# EAGLE design CAN3 (EAGLE 7.3.0)
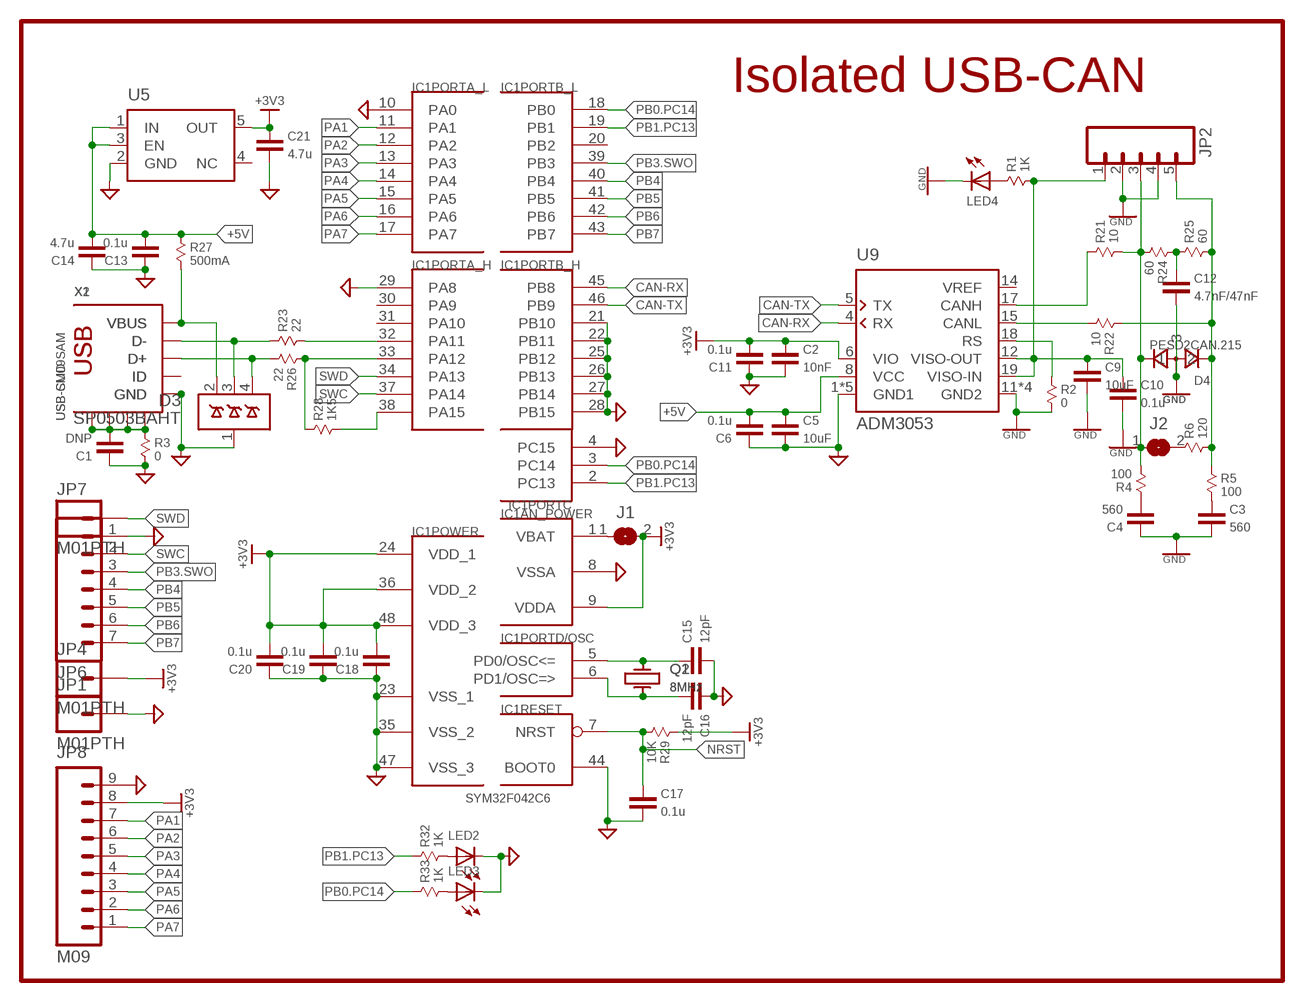
[diagram p0: schematic, sheet 1]

## Parts
C1  DNP  CAP-0603  [0603]
C2  10nF  CAP-0603  [0603]
C3  560  CAP-0603  [0603]
C4  560  CAP-0603  [0603]
C5  10uF  CAP-0805  [0805]
C6  0.1u  CAP-0603  [0603]
C9  10uF  CAP-0805  [0805]
C10  0.1u  CAP-0603  [0603]
C11  0.1u  CAP-0603  [0603]
C12  4.7nF/47nF  CAP-0603  [0603]
C13  0.1u  CAP-0603  [0603]
C14  4.7u  CAP-0603  [0603]
C15  12pF  CAP-0603  [0603]
C16  12pF  CAP-0603  [0603]
C17  0.1u  CAP-0603  [0603]
C18  0.1u  CAP-0603  [0603]
C19  0.1u  CAP-0603  [0603]
C20  0.1u  CAP-0603  [0603]
C21  4.7u  CAP-0603  [0603]
D3  SP0503BAHT  [SOT143]
D4  PESD2CAN.215  DIODE-2A-SOT23  [SOT-23]
IC1  SYM32F042C6  STM32F10XCXT6  [TQFP48]
J1  JUMPER2-0402  [JUMPER2-0402]
J2  JUMPER2-0402  [JUMPER2-0402]
JP1  M01PTH  [1X01]
JP2  M05PTH  [1X05]
JP4  M01PTH  [1X01]
JP6  M07  [1X07]
JP7  M01PTH  [1X01]
JP8  M09  [1X09]
LED2  LEDCHIPLED_0603  [CHIPLED_0603]
LED3  LEDCHIPLED_0603  [CHIPLED_0603]
LED4  LEDCHIPLED_0603  [CHIPLED_0603]
Q1  8MHz  CRYSTAL-KX-9A  [KX-9A]
Q2  8MHz  CRYSTAL-KX-7  [KX-7]
R1  1K  RESISTOR-0603  [0603]
R2  0  RESISTOR-0603  [0603]
R3  0  RESISTOR-0603  [0603]
R4  100  RESISTOR-0603  [0603]
R5  100  RESISTOR-0603  [0603]
R6  120  RESISTOR-0603  [0603]
R21  10  RESISTOR-0603  [0603]
R22  10  RESISTOR-0603  [0603]
R23  22  RESISTOR-0603  [0603]
R24  60  RESISTOR-0603  [0603]
R25  60  RESISTOR-0603  [0603]
R26  22  RESISTOR-0603  [0603]
R27  500mA  RESISTOR-0805  [0805]
R28  1K5  RESISTOR-0603  [0603]
R29  10K  RESISTOR-0603  [0603]
R32  1K  RESISTOR-0603  [0603]
R33  1K  RESISTOR-0603  [0603]
U5  TPS73033  [SOT23-5]
U9  ADM3053  [SO20W]
X1  USB-SMD  [USB-MINIB]
X2  USB-CU09SAM  [CU09SAM]

## Nets
+3V3: C2.2 C11.1 C18.1 C19.1 C20.1 C21.2 IC1.9(AN_POWER:VDDA) IC1.24(POWER:VDD_1) IC1.36(POWER:VDD_2) IC1.48(POWER:VDD_3) J1.2 JP4.1 JP8.8 R29.1 U5.5(OUT) U9.6(VIO)
+5V: C5.2 C6.1 C13.1 C14.1 R27.1 U5.1(IN) U5.3(EN) U9.8(VCC)
CAN-H: D4.1 J2.1 JP2.3 R4.2 R21.2 R24.2
CAN-L: D4.2 JP2.5 R5.1 R6.2 R22.1 R25.2
CAN-RX: IC1.45(PORTB_H:PB8) U9.4(RX)
CAN-TX: IC1.46(PORTB_H:PB9) U9.5(TX)
CANH: R21.1 U9.17(CANH)
CANL: R22.2 U9.15(CANL)
GNDA: C3.1 C4.2 C9.1 C10.1 C12.1 D4.3 JP2.2 JP2.4 LED4.C R2.2 U9.11(GND2) U9.13(GND2) U9.16(GND2) U9.20(GND2) ; supply symbol labelled GND
GNDD: C1.2 C2.1 C5.1 C6.2 C11.2 C13.2 C14.2 C15.1 C16.2 C17.1 C18.2 C19.2 C20.2 C21.1 D3.1(GND) IC1.4(PORTC:PC15) IC1.8(AN_POWER:VSSA) IC1.10(PORTA_L:PA0) IC1.21(PORTB_H:PB10) IC1.22(PORTB_H:PB11) IC1.23(POWER:VSS_1) IC1.25(PORTB_H:PB12) IC1.26(PORTB_H:PB13) IC1.27(PORTB_H:PB14) IC1.28(PORTB_H:PB15) IC1.29(PORTA_H:PA8) IC1.35(POWER:VSS_2) IC1.44(RESET:BOOT0) IC1.47(POWER:VSS_3) JP1.1 JP6.1 JP8.9 LED2.C LED3.C R3.2 U5.2(GND) U9.1(GND1) U9.3(GND1) U9.7(GND1) U9.9(GND1) U9.10(GND1) X1.GND X2.5(GND) ; supply symbol labelled GND
N$1: LED4.A R1.1
N$2: R2.1 U9.18(RS)
N$3: C12.2 R24.1 R25.1
N$4: X1.ID X2.4(ID)
N$5: C1.1 R3.1 X1.GND@1(GND) X1.GND@2(GND) X1.GND@3(GND) X1.GND@4(GND) X2.GND@1(GND) X2.GND@2(GND) X2.GND@3(GND) X2.GND@4(GND)
N$6: IC1.1(AN_POWER:VBAT) J1.1
N$7: IC1.32(PORTA_H:PA11) R23.2
N$8: LED2.A R32.2
N$9: C3.2 R5.2
N$10: C4.1 R4.1
N$11: J2.2 R6.1
N$13: LED3.A R33.2
N$14: IC1.33(PORTA_H:PA12) R26.1 R28.1
N$15: D3.4(D3) R26.2 X1.D+ X2.3(D+)
N$16: D3.3(D2) R23.1 X1.D- X2.2(D-)
N$18: D3.2(D1) R27.2 X1.VBUS X2.1(VBUS)
N$23: IC1.38(PORTA_H:PA15) R28.2
N$24: C15.2 IC1.5(PORTD/OSC:PD0/OSC<=) Q1.1 Q2.1
N$25: C16.1 IC1.6(PORTD/OSC:PD1/OSC=>) Q1.3 Q2.3
NRST: C17.2 IC1.7(RESET:NRST) R29.2
PA1: IC1.11(PORTA_L:PA1) JP8.7
PA2: IC1.12(PORTA_L:PA2) JP8.6
PA3: IC1.13(PORTA_L:PA3) JP8.5
PA4: IC1.14(PORTA_L:PA4) JP8.4
PA5: IC1.15(PORTA_L:PA5) JP8.3
PA6: IC1.16(PORTA_L:PA6) JP8.2
PA7: IC1.17(PORTA_L:PA7) JP8.1
PB0.PC14: IC1.3(PORTC:PC14) IC1.18(PORTB_L:PB0) R33.1
PB1.PC13: IC1.2(PORTC:PC13) IC1.19(PORTB_L:PB1) R32.1
PB3.SWO: IC1.39(PORTB_L:PB3) JP6.3
PB4: IC1.40(PORTB_L:PB4) JP6.4
PB5: IC1.41(PORTB_L:PB5) JP6.5
PB6: IC1.42(PORTB_L:PB6) JP6.6
PB7: IC1.43(PORTB_L:PB7) JP6.7
SWC: IC1.37(PORTA_H:PA14) JP6.2
SWD: IC1.34(PORTA_H:PA13) JP7.1
VCC2: C9.2 C10.2 JP2.1 R1.2 U9.12(VISO-OUT) U9.19(VISO-IN)
Unconnected: IC1.20(PORTB_L:PB2) IC1.30(PORTA_H:PA9) IC1.31(PORTA_H:PA10) U5.4(NC) U9.14(VREF)

## Notes on the sheet
- Isolated USB-CAN

## Library data of the parts
C1-C6 C9-C21 = X893:CAP: Capacitor
D3 = X893:SP0503BAHT: Surface Mount TVS Avalanche Diode Array (5V) http://www.littelfuse.com/data/en/Data_Sheets/SP05xxBA.pdf
D4 = X893:DIODE-2A: http://www.nxp.com/documents/data_sheet/BAT54W.pdf
IC1 = stm32:STM32F10XCXT6: ST STM32F101/103 48pin LQFP
J1 J2 = we-rcl:JUMPER2: 2 Pin Jumpers
JP1 JP4 JP7 = SparkFun:M01: Header 1 Standard 1-pin 0.1" header. Use with straight break away headers (SKU : PRT-00116), right angle break away headers (PRT-00553), swiss pins (PRT-00743), machine pins (PRT-00117), and female headers (PRT-00115).
JP2 = SparkFun:M05: Header 5 Standard 5-pin 0.1" header. Use with straight break away headers (SKU : PRT-00116), right angle break away headers (PRT-00553), swiss pins (PRT-00743), machine pins (PRT-00117), and female headers (PRT-00115). Molex polarized connector foot print use with SKU : PRT-08230 with associated crimp pins and housings.
JP6 = SparkFun:M07: Header 7 Standard 7-pin 0.1" header. Use with straight break away headers (SKU : PRT-00116), right angle break away headers (PRT-00553), swiss pins (PRT-00743), machine pins (PRT-00117), and female headers (PRT-00115). NOTES ON THE VARIANTS LOCK and LOCK_LONGPADS... This footprint was designed to help hold the alignment of a through-hole component (i.e. 7-pin header) while soldering it into place. You may notice that each hole has been shifted either up or down by 0.005 of an inch from it's more standard position (which is usually a perfectly straight line). This slight alteration caused the pins (the squares in the middle) to touch the edges of the holes. Because they are alternating, it causes a "brace" to hold the header in place. 0.005 has proven to be the perfect amount of "off-center" position when using our standard breakaway headers. Although looks a little odd when you look at the bare footprint, once you have a header in there, the alteration is very hard to notice. Also, if you push a header all the way into place, it is covered up entirely on the bottom side. This idea of altering the position of holes to aid alignment will be further integrated into the Sparkfun Library for other footprints. It can help hold any component with 3 or more connection pins.
JP8 = SparkFun:M09: Header 9 Standard 9-pin 0.1" header. Use with straight break away headers (SKU : PRT-00116), right angle break away headers (PRT-00553), swiss pins (PRT-00743), machine pins (PRT-00117), and female headers (PRT-00115).
LED2-LED4 = led:LED: LED OSRAM: - CHIPLED LG R971, LG N971, LY N971, LG Q971, LY Q971, LO R971, LY R971 LH N974, LH R974 LS Q976, LO Q976, LY Q976 LO Q996 - Hyper CHIPLED LW Q18S LB Q993, LB Q99A, LB R99A - SideLED LS A670, LO A670, LY A670, LG A670, LP A670 LB A673, LV A673, LT A673, LW A673 LH A674 LY A675 LS A676, LA A676, LO A676, LY A676, LW A676 LS A679, LY A679, LG A679 - Hyper Micro SIDELED® LS Y876, LA Y876, LO Y876, LY Y876 LT Y87S - SmartLED LW L88C, LW L88S LB L89C, LB L89S, LG L890 LS L89K, LO L89K, LY L89K LS L896, LA L896, LO L896, LY L896 - TOPLED LS T670, LO T670, LY T670, LG T670, LP T670 LSG T670, LSP T670, LSY T670, LOP T670, LYG T670 LG T671, LOG T671, LSG T671 LB T673, LV T673, LT T673, LW T673 LH T674 LS T676, LA T676, LO T676, LY T676, LB T676, LH T676, LSB T676, LW T676 LB T67C, LV T67C, LT T67C, LS T67K, LO T67K, LY T67K, LW E67C LS E67B, LA E67B, LO E67B, LY E67B, LB E67C, LV E67C, LT E67C LW T67C LS T679, LY T679, LG T679 LS T770, LO T770, LY T770, LG T770, LP T770 LB T773, LV T773, LT T773, LW T773 LH T774 LS E675, LA E675, LY E675, LS T675 LS T776, LA T776, LO T776, LY T776, LB T776 LHGB T686 LT T68C, LB T68C - Hyper Mini TOPLED® LB M676 - Mini TOPLED Santana® LG M470 LS M47K, LO M47K, LY M47K Source: http://www.osram.convergy.de LUXEON: - LUMILED® LXK2-PW12-R00, LXK2-PW12-S00, LXK2-PW14-U00, LXK2-PW14-V00 LXK2-PM12-R00, LXK2-PM12-S00, LXK2-PM14-U00 LXK2-PE12-Q00, LXK2-PE12-R00, LXK2-PE12-S00, LXK2-PE14-T00, LXK2-PE14-U00 LXK2-PB12-K00, LXK2-PB12-L00, LXK2-PB12-M00, LXK2-PB14-N00, LXK2-PB14-P00, LXK2-PB14-Q00 LXK2-PR12-L00, LXK2-PR12-M00, LXK2-PR14-Q00, LXK2-PR14-R00 LXK2-PD12-Q00, LXK2-PD12-R00, LXK2-PD12-S00 LXK2-PH12-R00, LXK2-PH12-S00 LXK2-PL12-P00, LXK2-PL12-Q00, LXK2-PL12-R00 Source: www.luxeon.com KINGBRIGHT: KA-3528ASYC Source: www.kingbright.com
Q1 Q2 = X893:CRYSTAL: KX-9A <http://www.kosmodrom.com.ua/pdf/KX-9A.pdf> KX-KT <http://www.kosmodrom.com.ua/pdf/KX-K.pdf>
R1-R6 R21-R29 R32 R33 = X893:RESISTOR
U5 = X893:TPS73033: LOW-NOISE, HIGH PSRR, RF 200-mA LOW-DROPOUT LINEAR REGULATOR http://www.terraelectronica.ru/pdf/TI/TPS73033.pdf
U9 = X893:ADM3053: ADM3053 <http://www.analog.com/media/en/technical-documentation/data-sheets/ADM3053.pdf> EVAL–ADM3053EBZ <http://www.analog.com/media/en/technical-documentation/user-guides/UG-234.pdf>
X1 X2 = X893:USB: USB Connectors USB-B-PTH is fully proven SKU : PRT-00139 USB-miniB is fully proven SKU : PRT-00587 USB-A-PCB is untested. USB-A-H is throughly reviewed, but untested. Spark Fun Electronics SKU : PRT-00437 USB-B-SMT is throughly reviewed, but untested. Needs silkscreen touching up. USB-A-S has not been used/tested USB-MB-H has not been used/tested

## Board
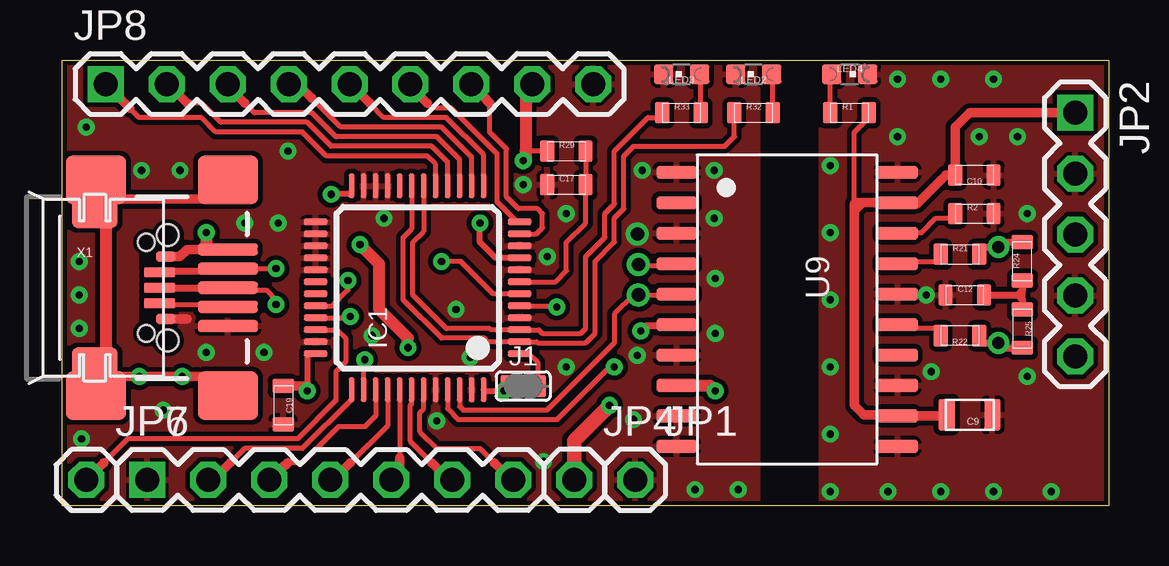
[diagram p1: board, top side]
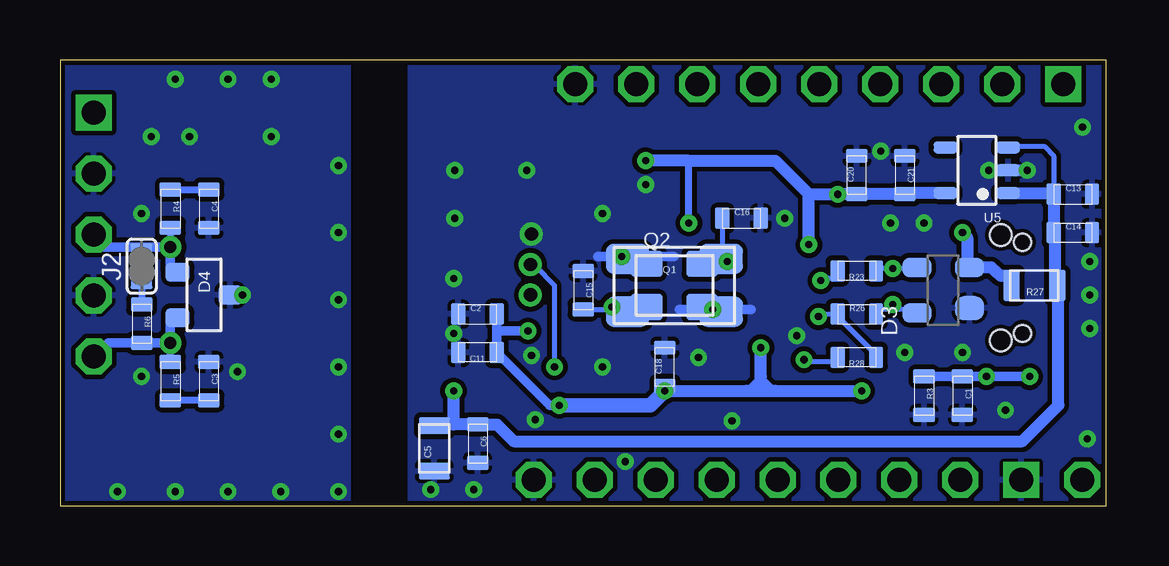
[diagram p2: board, bottom side, seen from below]

Size 43.6 x 18.6 mm. Coordinates in mm from the lower left corner, seen from the top.
Outline: 0,0 0,18.6 43.6,18.6 43.6,0 0,0
Copper layers (1+16): Top 0.018mm / dielectric 0.8mm / Bottom 0.018mm
Design rules "Rezonit-015": minimum track width 0.15mm, minimum drill 0.3mm, track to track 0.15mm, track to pad 0.15mm, pad to pad 0.15mm, via to via 0.15mm, smd to smd 0mil, copper to edge 0.2mm, drill to drill 0.3mm, minimum pad ring 0.2mm, minimum via ring 0.2mm, stop-mask expansion 4mil, vias tented up to drill 0.3mm, thermal gap 0.15mm

### Footprints (pad centres in the part's own frame; a part is rotated, then mirrored left to right if it is on the bottom)
0603 = smd 0.6 x 0.9: 1 -0.8,0; 2 0.8,0
0805 = smd 0.7 x 1.3: 1 -0.95,0; 2 0.95,0
SOT143 = smd 1 x 1.2: 1 -0.75,-1.1 | smd 0.8 x 1.2: 2 0.95,-1.1; 3 0.95,1.1; 4 -0.95,1.1
SOT-23 = smd 0.8 x 1: 1 -0.95,-1.1; 2 0.95,-1.1; 3 0,1.1
TQFP48 = smd 0.25 x 1: 1 -2.75,-4.25; 2 -2.25,-4.25; 3 -1.75,-4.25; 4 -1.25,-4.25; 5 -0.75,-4.25; 6 -0.25,-4.25; 7 0.25,-4.25; 8 0.75,-4.25; 9 1.25,-4.25; 10 1.75,-4.25; 11 2.25,-4.25; 12 2.75,-4.25; 25 2.75,4.25; 26 2.25,4.25; 27 1.75,4.25; 28 1.25,4.25; 29 0.75,4.25; 30 0.25,4.25; 31 -0.25,4.25; 32 -0.75,4.25; 33 -1.25,4.25; 34 -1.75,4.25; 35 -2.25,4.25; 36 -2.75,4.25 | smd 1 x 0.25: 13 4.25,-2.75; 14 4.25,-2.25; 15 4.25,-1.75; 16 4.25,-1.25; 17 4.25,-0.75; 18 4.25,-0.25; 19 4.25,0.25; 20 4.25,0.75; 21 4.25,1.25; 22 4.25,1.75; 23 4.25,2.25; 24 4.25,2.75; 37 -4.25,2.75; 38 -4.25,2.25; 39 -4.25,1.75; 40 -4.25,1.25; 41 -4.25,0.75; 42 -4.25,0.25; 43 -4.25,-0.25; 44 -4.25,-0.75; 45 -4.25,-1.25; 46 -4.25,-1.75; 47 -4.25,-2.25; 48 -4.25,-2.75
JUMPER2-0402 = smd 0.9 x 0.8: 1 0,0.55; 2 0,-0.55
1X01 = drill 1 pad 1.5 octagon: 1 0,0
1X05 = drill 1 pad 1.5 square: 1 0,0 | drill 1 pad 1.5 octagon: 2 2.54,0; 3 5.08,0; 4 7.62,0; 5 10.16,0
1X07 = drill 1 pad 1.5 square: 1 0,0 | drill 1 pad 1.5 octagon: 2 2.54,0; 3 5.08,0; 4 7.62,0; 5 10.16,0; 6 12.7,0; 7 15.24,0
1X09 = drill 1 pad 1.5 square: 1 0,0 | drill 1 pad 1.5 octagon: 2 2.54,0; 3 5.08,0; 4 7.62,0; 5 10.16,0; 6 12.7,0; 7 15.24,0; 8 17.78,0; 9 20.32,0
CHIPLED_0603 = smd 0.8 x 0.8: A 0,-0.75; C 0,0.75
KX-9A = smd 1.8 x 1.25: 1 -1.95,-1.1; 2 1.95,-1.1; 3 1.95,1.1; 4 -1.95,1.1
KX-7 = smd 1.3 x 1.1: 1 -1.15,-0.9; 2 1.15,-0.9; 3 1.15,0.9; 4 -1.15,0.9
SOT23-5 = smd 0.5 x 1: 1 -0.95,-1.3; 2 0,-1.3; 3 0.95,-1.3; 4 0.95,1.3; 5 -0.95,1.3
SO20W = smd 0.55 x 1.7: 1 -5.715,-4.6; 2 -4.445,-4.6; 3 -3.175,-4.6; 4 -1.905,-4.6; 5 -0.635,-4.6; 6 0.635,-4.6; 7 1.905,-4.6; 8 3.175,-4.6; 9 4.445,-4.6; 10 5.715,-4.6; 11 5.715,4.6; 12 4.445,4.6; 13 3.175,4.6; 14 1.905,4.6; 15 0.635,4.6; 16 -0.635,4.6; 17 -1.905,4.6; 18 -3.175,4.6; 19 -4.445,4.6; 20 -5.715,4.6
USB-MINIB = smd 2.5 x 0.5: D+ 2.5,0; D- 2.5,0.8; GND 2.5,-1.6; ID 2.5,-0.8; VBUS 2.5,1.6 | smd 2.5 x 2: GND@1 -3,-4.5; GND@2 -3,4.5; GND@3 2.5,4.5; GND@4 2.5,-4.5 | hole 0.9: 0,2.2; 0,-2.2
CU09SAM = smd 0.4 x 0.8: 1 1.3,-5.1; 5 -1.3,-5.1 | smd 0.4 x 1.3: 2 0.65,-4.85; 3 0,-4.85; 4 -0.65,-4.85 | smd 1.8 x 1.9: GND@1 -3.4,-2.15; GND@4 3.4,-2.15 | smd 1 x 1: GND@2 -3.2,-2.2; GND@3 3.2,-2.2 | hole 0.7: -1.9,-4.3; 1.9,-4.3

### Placement (x,y rotation side)
C1  6,4.6 270 bottom
C2  26.2,8 0 bottom
C3  37.4,5.2 270 bottom
C4  37.4,12.4 270 bottom
C5  28,2.4 90 bottom
C6  26.2,2.6 270 bottom
C9  37.8,3.8 180 top
C10  38,13.8 180 top
C11  26.2,6.4 180 bottom
C12  37.6,8.8 0 top
C13  1.4,13 0 bottom
C14  1.4,11.4 0 bottom
C15  21.8,9 270 bottom
C16  15.2,12 0 bottom
C17  21,13.4 0 top
C18  18.4,5.8 90 bottom
C19  9.2,4.2 270 top
C20  10.4,13.8 90 bottom
C21  8.4,13.8 270 bottom
D3  6.8,9 90 bottom
D4  37.6,8.8 270 bottom
IC1  14.8,9.1 90 top
J1  19.2,5 270 top
J2  40.2,10 0 bottom
JP1  23.86,1.08 0 top
JP2  42.2,16.4 270 top
JP4  21.32,1.08 0 top
JP6  3.54,1.08 0 top
JP7  1,1.08 0 top
JP8  1.8,17.59 0 top
LED2  28.8,18 90 top
LED3  25.8,18 90 top
LED4  32.8,18 270 top
Q1  18,9.2 0 bottom
Q2  18,9.2 0 bottom
R1  32.8,16.4 0 top
R2  38,12.2 0 top
R3  7.6,4.6 270 bottom
R4  39,12.4 270 bottom
R5  39,5.2 270 bottom
R6  40.2,7.6 270 bottom
R21  37.4,10.5 0 top
R22  37.4,7.1 180 top
R23  10.4,9.8 180 bottom
R24  40,10.2 90 top
R25  40,7.4 270 top
R26  10.4,8 0 bottom
R27  3,9.2 180 bottom
R28  10.4,6.2 180 bottom
R29  21,14.8 0 top
R32  28.8,16.4 0 top
R33  25.8,16.4 0 top
U5  5.4,14 90 bottom
U9  30.2,8.2 270 top
X1  4.4,9.1 0 top
X2  -0.8,9.1 90 top

### Tracks (layer width: path | path; a pad name or v marks a point on that pad's centre or on a via)
+3V3  (via drill 0.3)
  Top 0.2: IC1.36 10.2,6.35 | IC1.24 12,13 | 12.5,10.9 v12.4,10.9 | R29.1 19.3,14.8 | J1.2 v18.4,4.8
  Top 0.25: 10.2,6.35 10.2,5 | IC1.9 18.05,10.35 17.4,11 v17.4,11.8 | 12,13 v11.2,13 | IC1.48 17.6,4.8 v18.4,4.8
  Top 0.3: U9.6 25.5,7.5 24.3,7.5 v24.1,7.3
  Top 0.4: C19.1 10.2,5 v10.2,4.8
  Top 0.5: v14.4,6.6 14.4,7 13.2,8.2 13.2,10.1 v12.4,10.9 | JP8.8 19.3,17.31 19.3,14.8 19.3,14.4 v19.2,14.4
  Top 0.6: JP4.1 21.32,2.72 v22.8,4.2
  Bottom 0.2: 15,4.8 14.4,5.4 13.8,4.8 | C18.1 v18.4,4.8
  Bottom 0.3: v17.4,11.8 17.4,14.4
  Bottom 0.4: v22.8,4.2 23.2,4.2 C11.1 25.4,7.3 | C2.2 25.4,7.3 | v24.1,7.3 25.4,7.3
  Bottom 0.5: v18.4,4.8 15,4.8 14.4,4.8 | 14.4,4.8 13.8,4.8 v10.2,4.8 | 12.4,13 v11.2,13 C20.1 C21.2 8.4,13.05 U5.5 | v12.4,10.9 12.4,13 | 12.4,13 13.8,14.4 17.4,14.4 v19.2,14.4 | 14.4,4.8 14.4,5.4 v14.4,6.6
  Bottom 0.6: v18.4,4.8 19,4.2 v22.8,4.2
+5V  (via drill 0.3)  (1 unrouted)
  Top 0.5: U9.8 26.98,5.03 v27.2,4.8
  Bottom 0.2: 2.2,13.05 2.2,14.6 2.6,15 4.05,15 U5.3 4.15,14.95
  Bottom 0.5: U5.1 2.2,13.05 C14.1 2.15,11.4 2.15,9.2 R27.1 2,9.15 2,4.2 3.5,2.7 24.7,2.7 25.4,3.4 C6.1 27.2,3.4 | C5.2 28,3.4 27.2,3.4 | 27.2,3.4 v27.2,4.8
CAN-H  (via drill 0.5)
  Top 0.3: 38.35,10.55 R21.2 38.2,10.8 v39,10.8 39.2,11 R24.2
  Bottom 0.3: D4.1 38.7,9.8 | R4.2 v39,10.8 | J2.1 40.2,10.8
  Bottom 0.4: 38.6,9.8 38.7,9.8 39,9.8 v39,10.8 40.2,10.8 42.12,10.8 42.12,11.32 JP2.3
CAN-L  (via drill 0.5)
  Top 0.3: 38.35,7.05 R22.1 38.2,6.8 v39,6.8 39.2,6.6 R25.2
  Bottom 0.3: D4.2 38.75,7.85 38.6,7.8 | R5.1 v39,6.8
  Bottom 0.4: 38.6,7.8 39,7.8 v39,6.8 R6.2 41.6,6.8 42.16,6.24 JP2.5
CAN-RX  (via drill 0.3, 0.56)
  Top 0.2: U9.4 25.5,10 24,10 v24,10.07 | v23,5.8 22.8,5.8 20.6,3.6 16.5,3.6 16.05,4.05 IC1.45
  Bottom 0.2: v24,10.07 24,10 23.8,10 23,9.2 v23,5.8
CAN-TX  (via drill 0.56)
  Top 0.2: U9.5 25.43,8.8 v24,8.8 23.8,8.8 23,8 23,6.8 20.2,4 16.7,4 16.55,4.15 IC1.46
CANH
  Top 0.2: U9.17 35.3,10.11 35.4,10.2 36.6,10.2 R21.1
CANL
  Top 0.2: R22.2 36.6,7.4 35.4,7.4 35.4,7.57 U9.15
GNDA  (via drill 0.3)
  other vias: 34.8,17.8 36.6,17.8 38.8,17.8 34.4,0.6 36.6,0.6 38.8,0.6 41.2,0.6 32,0.6 32,3 32,14.2 36,8.8 34.8,15.4 40.2,12.2 39.8,15.4 38.2,15.4 36.2,5.6 40.2,5.4 32,11.4 32,8.6 32,5.8
  pour Top (isolate 0.2): 31.6,0.2 43.4,0.2 43.4,18.4 31.6,18.4
  pour Bottom (isolate 0.2): 31.6,0.2 43.4,0.2 43.4,18.4 31.6,18.4
GNDD  (via drill 0.3, 0.56)
  Top 0.4: 4.4,7.8 5.2,7.8
  Bottom 0.4: 21.2,10.4 18,10.4 | 17.8,8.2 14.8,8.2
  Bottom 0.5: v4.9,14 3.2,14
  other vias: 12.9,7.1 0.8,2.8 8.4,6.4 13.4,12 0.7,10.2 0.7,7.4 1,15.8 7.6,11.8 0.7,8.8 6,6.4 17,6.2 21,5.8 23.8,3.6 28.16,0.68 26.36,0.68 15.6,3.55 23.96,6.28 27.2,9.48 27.16,14 27.16,12 23.96,11.34 24.16,14 9.4,14.8 9,11.8 4.2,4 27.2,7.2 19.2,13.4 21,12.2 16.4,8.2 20.2,10.4 3.3,14 20.05,1.85
  pour Top (isolate 0.2): 0.2,0.2 29,0.2 29,18.4 0.2,18.4
  pour Bottom (isolate 0.2): 0.2,0.2 29,0.2 29,18.4 0.2,18.4
N$1
  Top 0.2: R1.1 32,17.75 LED4.A
N$2
  Top 0.2: U9.18 35.38,11.38 35.4,11.4 35.8,11.4 36.4,12 37.2,12 R2.1
N$3
  Top 0.3: R24.1 40,9 | 40,9 39.8,8.8 | 39.8,8.8 40,8.6 | 40,8.6 R25.1 | C12.2 39.8,8.8 | 40,8.6 40,9
N$4
  Top 0.2: X2.4 4.2,8.45 4.2,8.4 6.9,8.4 X1.ID
N$5  (via drill 0.3)
  Top 0.4: 2.2,12.8 6.8,12.8 6.8,13.6 X1.GND@3 | 2.2,12.8 2.2,13.6 X1.GND@2 | 2.2,12.8 1.35,12.8 X2.GND@4 1.4,12.5 X2.GND@3 1.8,12.3 | 1.8,5.9 X2.GND@2 1.4,5.7 X2.GND@1 1.35,4.6 X1.GND@1 1.4,5.4 v3.2,5.4 6.8,5.4 6.8,4.6 X1.GND@4
  Top 0.5: 1.8,12.3 1.8,5.9
  Bottom 0.4: R3.1 C1.1 v3.2,5.4 v5,5.4
N$6
  Top 0.2: 19,6.35 IC1.1 19.45,6.35 19.8,6 19.8,4.95 J1.1
N$7  (via drill 0.3)
  Top 0.2: IC1.32 11.25,8.35 11.9,9 v11.9,9.4
  Bottom 0.2: v11.9,9.4 11.8,9.5 11.2,9.5 R23.2
N$8
  Top 0.2: R32.2 29.6,17.75 LED2.A
N$9
  Bottom 0.3: C3.2 R5.2
N$10
  Bottom 0.3: R4.1 C4.1
N$11
  Bottom 0.3: J2.2 R6.1
N$13
  Top 0.2: R33.2 26.6,17.75 LED3.A
N$14  (via drill 0.3)
  Top 0.2: IC1.33 11.95,7.85 v12,7.9
  Bottom 0.2: v12,7.9 11.9,8 R26.1 | R28.1 9.6,6.3 11.2,7.9 R26.1 | 11.2,7.95 R26.1
N$15  (via drill 0.3)
  Top 0.2: X1.D+ 7,9 8.5,9 8.9,8.6 v8.9,8.4
  Top 0.3: X2.3 X1.D+
  Bottom 0.2: 8.9,8.2 9.6,8.2 R26.2 | D3.4 7.9,8.2 8.9,8.2 | 8.9,8.2 v8.9,8.4
N$16  (via drill 0.3)
  Top 0.2: v8.9,9.9 X1.D- 6.9,9.8 | X2.2 4.1,9.8
  Top 0.3: 4.1,9.8 6.9,9.8
  Bottom 0.2: 9.6,9.6 R23.1 9.6,9.9 v8.9,9.9 8.2,9.9 8.11,9.89 D3.3
N$18  (via drill 0.3)
  Top 0.4: X2.1 4.9,10.4 5.2,10.7 6,10.7 X1.VBUS
  Top 0.5: v6,11.4 6,10.7
  Bottom 0.5: R27.2 4,9.2 4,9.6 4.4,9.6 4.8,9.95 D3.2 5.8,9.95 5.8,11.2 v6,11.4
N$23  (via drill 0.3)
  Top 0.2: IC1.38 12.55,6.05 v12.6,6.1
  Bottom 0.2: 11.2,6.4 R28.2 11.2,6 12.5,6 v12.6,6.1
N$24  (via drill 0.3)
  Top 0.2: IC1.5 20.55,8.35 v20.6,8.3
  Bottom 0.2: C15.2 20.2,8.2 Q1.1 20.4,8.1 v20.6,8.3 Q2.1
N$25  (via drill 0.3)
  Top 0.2: IC1.6 17.95,8.85 16.6,10.2 v15.8,10.2
  Bottom 0.2: C16.1 16,10.35 Q1.3 | Q1.3 16.05,10.05 v15.8,10.2 | Q2.3 16.05,10.1 Q1.3
NRST
  Top 0.2: R29.2 C17.2 21.8,11.8 21,11 21,9.8 20.55,9.35 IC1.7
PA1
  Top 0.2: IC1.11 19.75,11.35 20,11.6 20,12.2 19.8,12.4 19,12.4 18.5,12.9 18.5,14.9 17.8,15.6 17.8,16.8 | 17.2,17.44 JP8.7
  Top 0.4: 17.8,16.8 17.2,17.44
PA2
  Top 0.2: 15.2,16.8 15.4,16.6 16.2,16.6 18.1,14.7 18.1,12.7 18.95,11.85 IC1.12
  Top 0.4: JP8.6 14.5,17.5 15.2,16.8
PA3
  Top 0.2: IC1.13 17.55,14.65 16,16.2 13.4,16.2 12.8,16.8
  Top 0.4: JP8.5 11.99,17.59 12,17.6 12.8,16.8
PA4
  Top 0.2: IC1.14 17.05,14.55 15.8,15.8 11.6,15.8 10.4,17
  Top 0.4: JP8.4 9.59,17.59 9.6,17.6 9.8,17.6 10.4,17
PA5
  Top 0.2: IC1.15 16.55,14.45 15.6,15.4 11.4,15.4 10.4,16.4 8,16.4 7.6,16.8
  Top 0.4: JP8.3 6.88,17.52 7.6,16.8
PA6
  Top 0.2: IC1.16 16.05,14.35 15.4,15 11.2,15 10.2,16 6.6,16 5.8,16.8 5.2,16.8
  Top 0.4: JP8.2 4.41,17.59 5.2,16.8
PA7
  Top 0.2: IC1.17 15.55,14.25 15.2,14.6 11,14.6 10,15.6 6.4,15.6 5.8,16.2 3.2,16.2 2.8,16.6
  Top 0.4: 2.8,16.6 JP8.1
PB0.PC14
  Top 0.2: IC1.18 15.05,11.45 14.6,11 14.6,8.8 16,7.4 17.8,7.4 17.85,7.35 IC1.3 19.85,7.35 20,7.2 21.6,7.2 21.8,7.4 21.8,10.4 22.6,11.2 22.6,12.2 23,12.6 23,14.8 24.4,16.2 25,16.2 R33.1
PB1.PC13
  Top 0.2: IC1.19 14.55,11.55 14.2,11.2 14.2,8.6 15.8,7 17.6,7 17.75,6.85 IC1.2 19.75,6.85 19.8,6.8 21.8,6.8 22.2,7.2 22.2,10.2 23,11 23,12 23.4,12.4 23.4,14.6 23.8,15 27.6,15 28,15.4 R32.1
PB3.SWO
  Top 0.2: IC1.39 13.05,3.75 12.6,3.3 11.5,3.3 10,1.8 9.4,1.8 | 8.8,1.28 JP6.3
  Top 0.4: 9.4,1.8 8.8,1.28
PB4
  Top 0.2: IC1.40 13.55,3.35 12,1.8
  Top 0.4: 12,1.8 11.4,1.2 JP6.4
PB5
  Top 0.2: IC1.41 14.05,2
  Top 0.4: JP6.5 14.05,1.44 14.05,2
PB6
  Top 0.2: JP6.6 16.12,1.08 | 15.4,1.8 14.5,2.7 14.5,4.2 14.55,4.25 IC1.42
  Top 0.4: 15.4,1.8 16.12,1.08
PB7
  Top 0.2: JP6.7 18.72,1.08 18.6,1.2 | 18,1.8 17.4,2.4 15.6,2.4 14.9,3.1 14.9,3.9 15.05,4.05 IC1.43
  Top 0.4: 18,1.8 18.6,1.2
SWC
  Top 0.2: IC1.37 12.05,4.45 10,2.4 7.6,2.4 7,1.8 | JP6.2 6.12,1.08 6.2,1
  Top 0.4: 7,1.8 6.2,1
SWD
  Top 0.2: IC1.34 11.45,7.35 11.8,7 11.8,6 11.4,5.6 11.4,4.4 9.8,2.8 2.72,2.8 1.72,1.8
  Top 0.4: 1.72,1.8 JP7.1
VCC2
  Top 0.2: 33,12.6 33,15.6 33.6,16.2 R1.2 | 33,12.2 33.4,12.6
  Top 0.4: 36.8,4.2 36.85,4.15 C9.2 36.8,3.75 U9.12 34.76,3.8 33.4,3.8 33,4.2 33,12.2 33,12.6 33.05,12.64 U9.19 35.2,12.6 35.6,12.6 36.8,13.8 C10.2 37.2,15.8 37.8,16.4 JP2.1

### Text on the board
Reference: PA7 | PA6 | PA5 | PA4 | PA3 | PA2 | PA1 | +3.3 | GND | +5V | GND | CAN-H | GND | CAN-L | SWDIO | GND | SWCLK | PB3 | PB4 | PB5 | PB6 | PB7 | +3.3 | GND